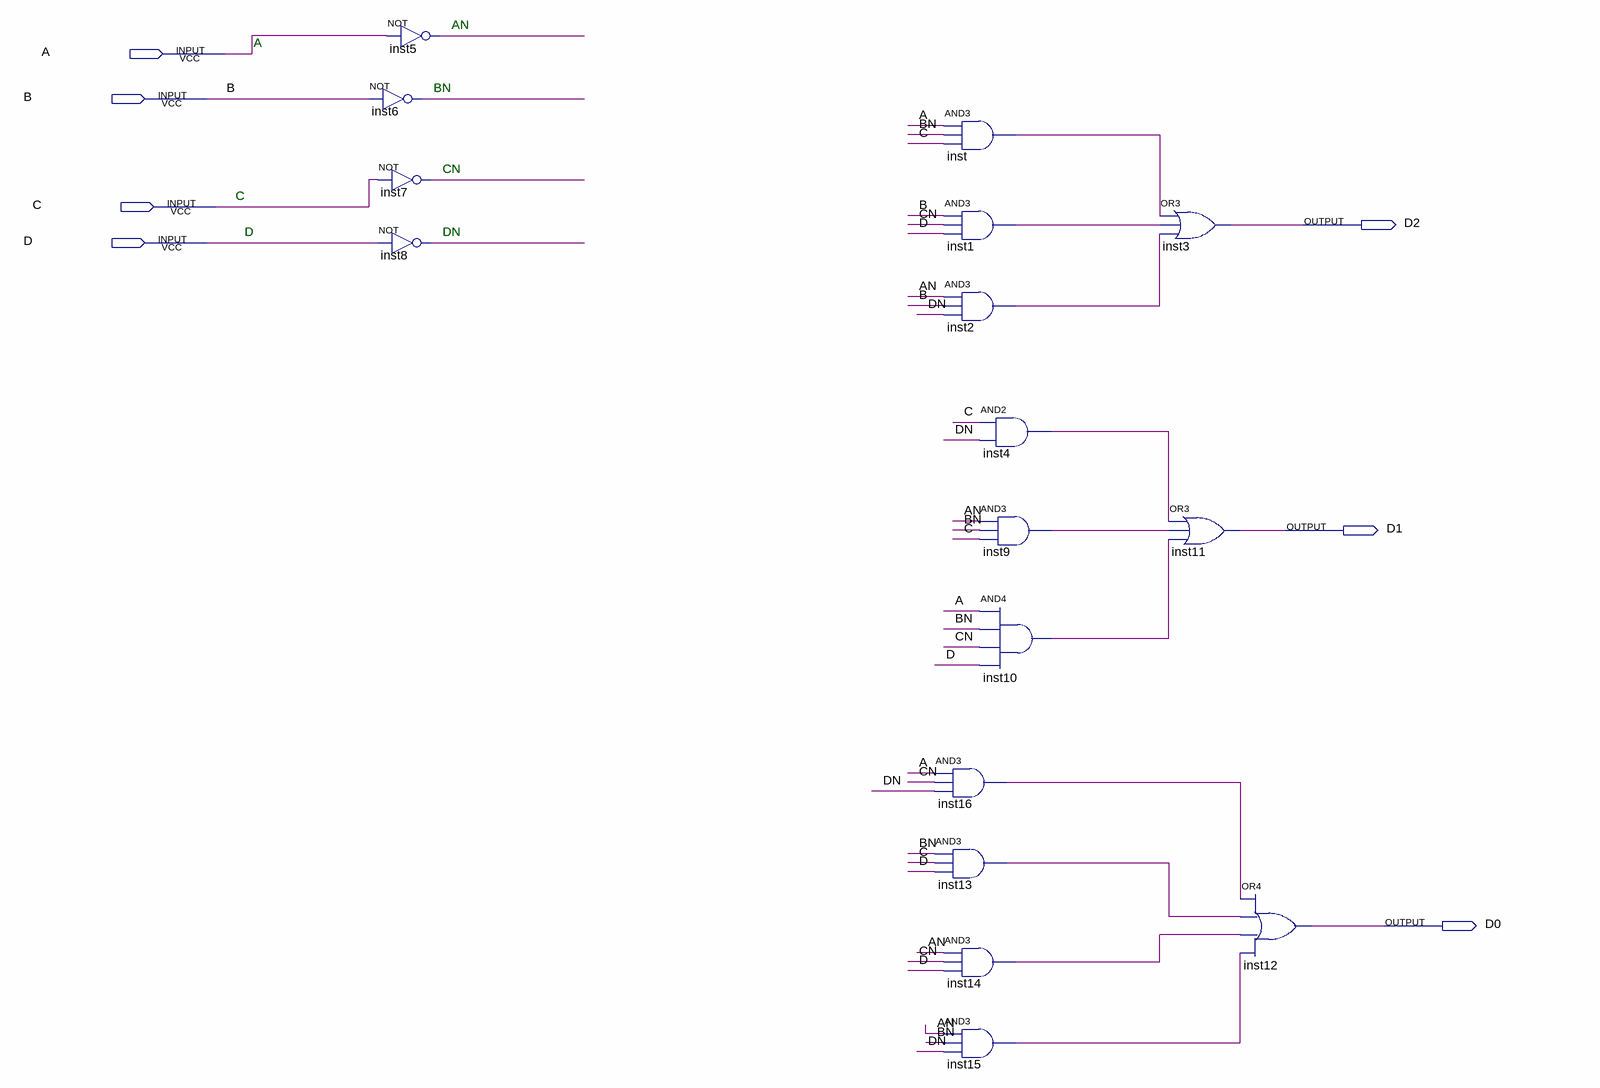
[diagram p0: schematic sheet]
// Quartus schematic lab5.bdf as structural Verilog: 17 symbols, 7 pins
module lab5 (
  input  A,
  input  B,
  input  C,
  input  D,
  output D2,
  output D1,
  output D0
);

  wire AN, BN, CN, DN, inst1_out, inst2_out, inst4_out, inst9_out, inst10_out, inst13_out, inst14_out,
       inst15_out, inst16_out, inst_out;

  not inst5 (AN, A);
  not inst6 (BN, B);
  not inst7 (CN, C);
  not inst8 (DN, D);
  and inst (inst_out, A, BN, C);
  and inst1 (inst1_out, B, CN, D);
  and inst2 (inst2_out, AN, B, DN);
  and inst4 (inst4_out, C, DN);
  and inst9 (inst9_out, AN, BN, C);
  and inst10 (inst10_out, A, BN, CN, D);
  and inst16 (inst16_out, A, CN, DN);
  and inst13 (inst13_out, BN, C, D);
  and inst14 (inst14_out, AN, CN, D);
  and inst15 (inst15_out, AN, BN, DN);
  or inst3 (D2, inst_out, inst1_out, inst2_out);
  or inst11 (D1, inst4_out, inst9_out, inst10_out);
  or inst12 (D0, inst16_out, inst13_out, inst14_out, inst15_out);

  // Notes on the sheet:
  //   AN
  //   A
  //   BN
  //   CN
  //   C
  //   D
  //   DN
endmodule
